# EasyEDA schematic SCH_GD32_KB.json
TITLE: Sheet_1; REV: 1.0; Date: 2022-07-10; Sheet: 1/1; Drawn By: wisdom_lee; Company: Your Company
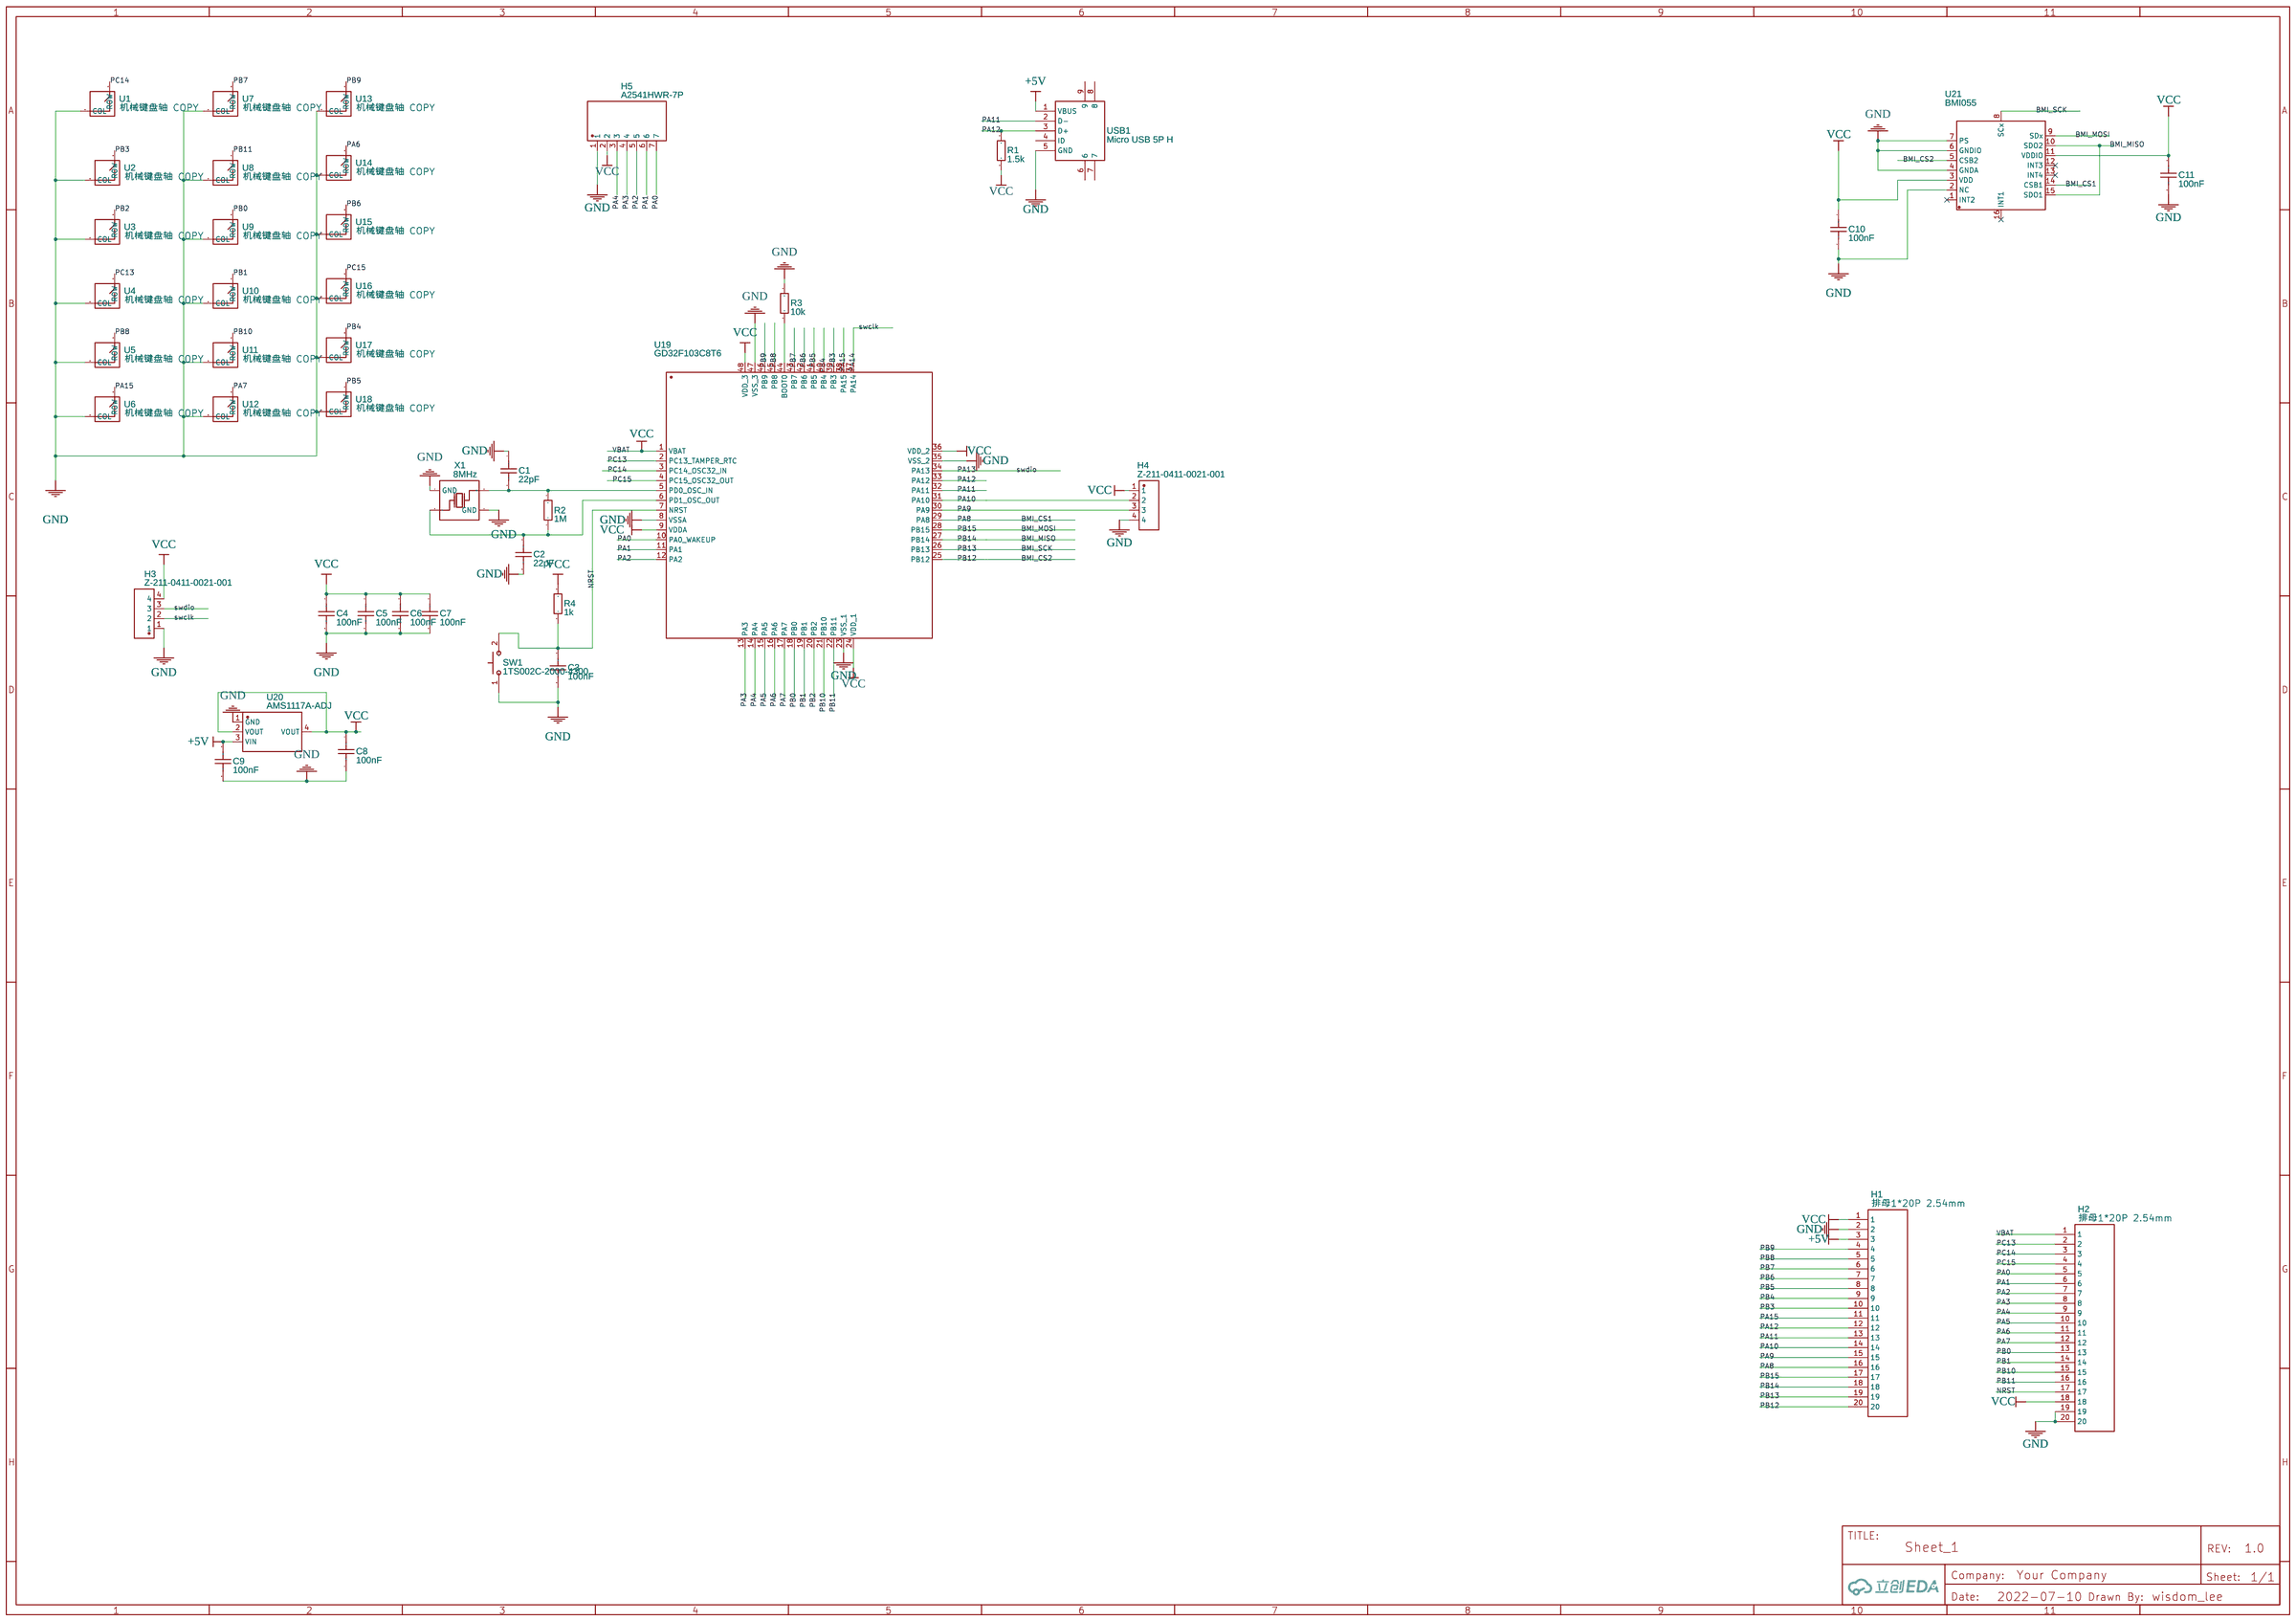
[diagram p0: schematic sheet]

## Parts
C1  22pF  [C0805]
C2  22pF  [C0805]
C3  100nF  [C0805]
C4  100nF  [C0805]
C5  100nF  [C0805]
C6  100nF  [C0805]
C7  100nF  [C0805]
C8  100nF  [C0805]
C9  100nF  [C0805]
C10  100nF  [C0805]
C11  100nF  [C0805]
H1  排母1*20P 2.54mm  [排母1*20P]
H2  排母1*20P 2.54mm  [排母1*20P]
H3  Z-211-0411-0021-001  [HDR-TH_4P-P2.54-V-M]
H4  Z-211-0411-0021-001  [HDR-TH_4P-P2.54-V-M]
H5  A2541HWR-7P  [HDR-TH_7P-P2.54-H-W8.6_A2541HWR-7P]
R1  1.5k  [R0805]
R2  1M  [R0805]
R3  10k  [R0805]
R4  1k  [R0805]
SW1  1TS002C-2000-4300  [SW-SMD_L6.0-W3.5-LS8.0-EH]
U1  机械键盘轴 COPY  [机械键盘轴]
U2  机械键盘轴 COPY  [机械键盘轴]
U3  机械键盘轴 COPY  [机械键盘轴]
U4  机械键盘轴 COPY  [机械键盘轴]
U5  机械键盘轴 COPY  [机械键盘轴]
U6  机械键盘轴 COPY  [机械键盘轴]
U7  机械键盘轴 COPY  [机械键盘轴]
U8  机械键盘轴 COPY  [机械键盘轴]
U9  机械键盘轴 COPY  [机械键盘轴]
U10  机械键盘轴 COPY  [机械键盘轴]
U11  机械键盘轴 COPY  [机械键盘轴]
U12  机械键盘轴 COPY  [机械键盘轴]
U13  机械键盘轴 COPY  [机械键盘轴]
U14  机械键盘轴 COPY  [机械键盘轴]
U15  机械键盘轴 COPY  [机械键盘轴]
U16  机械键盘轴 COPY  [机械键盘轴]
U17  机械键盘轴 COPY  [机械键盘轴]
U18  机械键盘轴 COPY  [机械键盘轴]
U19  GD32F103C8T6  [TQFP-48_L7.0-W7.0-P0.50-LS9.0-BL]
U20  AMS1117A-ADJ  [SOT-223_L6.3-W3.5-P2.30-LS7.0-BR]
U21  BMI055  [LGA-16_L4.5-W3.0-P0.50-BL]
USB1  Micro USB 5P H  [MICRO-USB_MICRO-USB-30]
X1  8MHz  [CRYSTAL-SMD_4P-L3.2-W2.5-BL]

## Library data of the parts
C1-C11 = CC0805KRX7R8BB223: Supplier: LCSC; Supplier Part: C327278; Manufacturer: YAGEO; Contributor: LCSC; JLCPCB Part Class: Extended Part
H1 H2 = 排母1*20P 2.54mm: Supplier: LCSC; Supplier Part: C169819; Manufacturer: Shenzhen Cankemeng; Contributor: Little_Wolf; JLCPCB Part Class: Extended Part; Package Display: No
H3 H4 = Z-211-0411-0021-001: Supplier: LCSC; Manufacturer: ZHENGLING; Contributor: LCSC; Supplier Part: C152150; JLCPCB Part Class: Extended Part
H5 = A2541HWR-7P: Supplier: LCSC; Supplier Part: C225515; Manufacturer: Changjiang Connectors; Contributor: LCSC; JLCPCB Part Class: Extended Part
R1-R4 = 0805W8F3922T5E_C60005: Supplier: LCSC; Supplier Part: C60005; Manufacturer: Uniroyal Elec; Manufacturer Part: 0805W8F3922T5E; Resistance (Ohms): 39.2K; Contributor: LCSC; JLCPCB Part Class: Extended Part
SW1 = 1TS002C-2000-4300: Supplier: LCSC; Supplier Part: C319339; Manufacturer: HYP; Contributor: LCSC; JLCPCB Part Class: Extended Part
U1-U18 = 机械键盘轴 COPY: Contributor: steven1995
U19 = GD32F103C8T6: Supplier: LCSC; Manufacturer: GigaDevice; Supplier Part: C77994; JLCPCB Part Class: Extended Part
U20 = AMS1117A-ADJ: Supplier: LCSC; Supplier Part: C2984864; Manufacturer: HX(恒佳兴); Contributor: lcsc
U21 = BMI055: Supplier: LCSC; Supplier Part: C189620; Manufacturer: Bosch Sensortec; Contributor: LCSC; JLCPCB Part Class: Extended Part
USB1 = Micro USB 5P H: Supplier: LCSC; Supplier Part: C40946; Manufacturer: LCSC; Contributor: LCSC; JLCPCB Part Class: Extended Part
X1 = 7M1204LCSC-EIE4S: Supplier: LCSC; Manufacturer: TXC; Contributor: LCSC; Supplier Part: C93114; JLCPCB Part Class: Extended Part

## Nets
+5V: C9.1 H1.3 U20.3(VIN) USB1.1(VBUS)
GND: C1.1 C2.2 C3.2 C4.2 C5.2 C6.2 C7.2 C8.2 C9.2 C10.2 C11.2 H1.2 H2.19 H2.20 H3.1 H4.4 H5.1 R3.2 SW1.1(A) U1.COL U2.COL U3.COL U4.COL U5.COL U6.COL U7.COL U8.COL U9.COL U10.COL U11.COL U12.COL U13.COL U14.COL U15.COL U16.COL U17.COL U18.COL U19.8(VSSA) U19.23(VSS_1) U19.35(VSS_2) U19.47(VSS_3) U20.1(GND) U21.2(NC) U21.4(GNDA) U21.6(GNDIO) U21.7(PS) USB1.5(GND) X1.2(GND) X1.4(GND)
VBAT: C4.1 C5.1 C6.1 C7.1 C8.1 C10.1 C11.1 H1.1 H2.1 H2.18 H3.4 H4.1 H5.2 R1.1 R4.2 U19.1(VBAT) U19.9(VDDA) U19.24(VDD_1) U19.36(VDD_2) U19.48(VDD_3) U20.2(VOUT) U20.4(VOUT) U21.3(VDD) U21.11(VDDIO)
BMI_CS1: H1.16 U19.29(PA8) U21.14(CSB1)
BMI_CS2: H1.20 U19.25(PB12) U21.5(CSB2)
BMI_MISO: H1.18 U19.27(PB14) U21.10(SDO2) U21.15(SDO1)
BMI_MOSI: H1.17 U19.28(PB15) U21.9(SDx)
BMI_SCK: H1.19 U19.26(PB13) U21.8(SCx)
NRST: C3.1 H2.17 R4.1 SW1.2(B) U19.7(NRST)
PA0: H2.5 H5.7 U19.10(PA0_WAKEUP)
PA1: H2.6 H5.6 U19.11(PA1)
PA2: H2.7 H5.5 U19.12(PA2)
PA3: H2.8 H5.4 U19.13(PA3)
PA4: H2.9 H5.3 U19.14(PA4)
PA5: H2.10 U19.15(PA5)
PA6: H2.11 U14.ROW U19.16(PA6)
PA7: H2.12 U12.ROW U19.17(PA7)
PA9: H1.15 H4.3 U19.30(PA9)
PA10: H1.14 H4.2 U19.31(PA10)
PA11: H1.13 U19.32(PA11) USB1.2(D-)
PA12: H1.12 R1.2 U19.33(PA12) USB1.3(D+)
PA13: H3.3 U19.34(PA13)
PA14: H3.2 U19.37(PA14)
PA15: H1.11 U6.ROW U19.38(PA15)
PB0: H2.13 U9.ROW U19.18(PB0)
PB1: H2.14 U10.ROW U19.19(PB1)
PB2: U3.ROW U19.20(PB2)
PB3: H1.10 U2.ROW U19.39(PB3)
PB4: H1.9 U17.ROW U19.40(PB4)
PB5: H1.8 U18.ROW U19.41(PB5)
PB6: H1.7 U15.ROW U19.42(PB6)
PB7: H1.6 U7.ROW U19.43(PB7)
PB8: H1.5 U5.ROW U19.45(PB8)
PB9: H1.4 U13.ROW U19.46(PB9)
PB10: H2.15 U11.ROW U19.21(PB10)
PB11: H2.16 U8.ROW U19.22(PB11)
PC13: H2.2 U4.ROW U19.2(PC13_TAMPER_RTC)
PC14: H2.3 U1.ROW U19.3(PC14_OSC32_IN)
PC15: H2.4 U16.ROW U19.4(PC15_OSC32_OUT)
Net-(C1-2): C1.2 R2.2 U19.5(PD0_OSC_IN) X1.3(OSC2)
Net-(C2-1): C2.1 R2.1 U19.6(PD1_OSC_OUT) X1.1(OSC1)
Net-(R3-1): R3.1 U19.44(BOOT0)

Not connected (* = marked no-connect by the designer): U21 1(INT2)* 12(INT3)* 13(INT4)* 16(INT1)*; USB1 4(ID) 6 7 8 9
